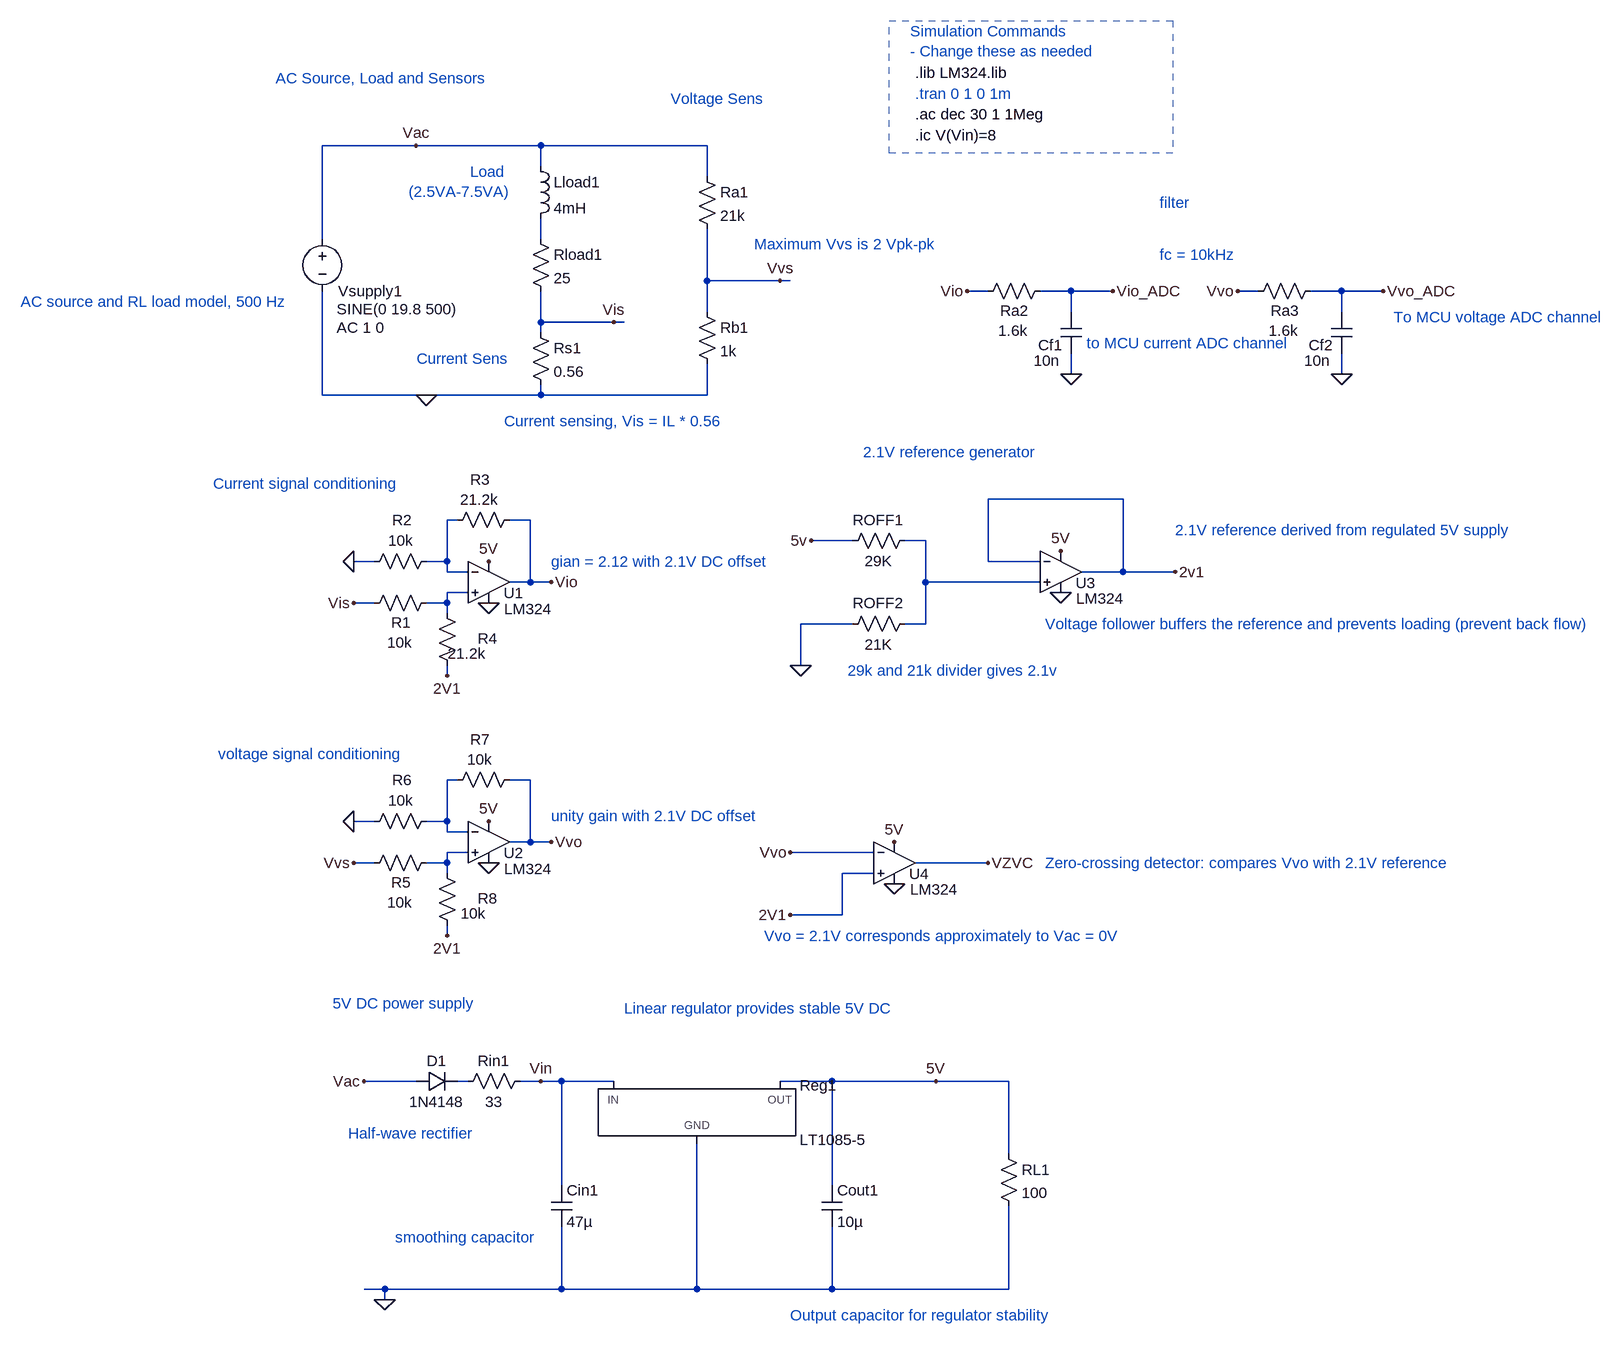
[diagram p0: schematic T28_Project1.asc]
T28_Project1.asc, the LTspice schematic file:
Version 4.1
SHEET 1 1580 1720
WIRE -320 -96 -464 -96
WIRE -128 -96 -320 -96
WIRE 128 -96 -128 -96
WIRE -128 -64 -128 -96
WIRE 128 -48 128 -96
WIRE -464 48 -464 -96
WIRE -128 48 -128 16
WIRE 128 112 128 32
WIRE 240 112 128 112
WIRE 256 112 240 112
WIRE 560 128 528 128
WIRE 688 128 640 128
WIRE 752 128 688 128
WIRE 976 128 944 128
WIRE 1104 128 1056 128
WIRE 1168 128 1104 128
WIRE 128 160 128 112
WIRE 688 160 688 128
WIRE 1104 160 1104 128
WIRE -128 176 -128 128
WIRE -16 176 -128 176
WIRE 0 176 -16 176
WIRE -128 192 -128 176
WIRE 688 256 688 224
WIRE 1104 256 1104 224
WIRE -464 288 -464 128
WIRE -304 288 -464 288
WIRE -128 288 -128 272
WIRE -128 288 -304 288
WIRE 128 288 128 240
WIRE 128 288 -128 288
WIRE 768 448 560 448
WIRE -256 480 -272 480
WIRE -144 480 -176 480
WIRE 352 512 288 512
WIRE 464 512 432 512
WIRE -384 544 -416 544
WIRE -272 544 -272 480
WIRE -272 544 -304 544
WIRE 560 544 560 448
WIRE 640 544 560 544
WIRE -272 560 -272 544
WIRE -240 560 -272 560
WIRE 768 560 768 448
WIRE 768 560 704 560
WIRE 848 560 768 560
WIRE -144 576 -144 480
WIRE -144 576 -176 576
WIRE -112 576 -144 576
WIRE 464 576 464 512
WIRE 640 576 464 576
WIRE -240 592 -272 592
WIRE -384 608 -416 608
WIRE -272 608 -272 592
WIRE -272 608 -304 608
WIRE -272 624 -272 608
WIRE 352 640 272 640
WIRE 464 640 464 576
WIRE 464 640 432 640
WIRE 272 704 272 640
WIRE -272 720 -272 704
WIRE -256 880 -272 880
WIRE -144 880 -176 880
WIRE -384 944 -416 944
WIRE -272 944 -272 880
WIRE -272 944 -304 944
WIRE -272 960 -272 944
WIRE -240 960 -272 960
WIRE -144 976 -144 880
WIRE -144 976 -176 976
WIRE -112 976 -144 976
WIRE -240 992 -272 992
WIRE 384 992 256 992
WIRE -384 1008 -416 1008
WIRE -272 1008 -272 992
WIRE -272 1008 -304 1008
WIRE 560 1008 448 1008
WIRE -272 1024 -272 1008
WIRE 384 1024 336 1024
WIRE 336 1088 336 1024
WIRE 336 1088 256 1088
WIRE -272 1120 -272 1104
WIRE -320 1344 -400 1344
WIRE -240 1344 -256 1344
WIRE -128 1344 -160 1344
WIRE -96 1344 -128 1344
WIRE -16 1344 -96 1344
WIRE 320 1344 240 1344
WIRE 480 1344 320 1344
WIRE 592 1344 480 1344
WIRE 592 1456 592 1344
WIRE -96 1504 -96 1344
WIRE 320 1504 320 1344
WIRE -368 1664 -400 1664
WIRE -96 1664 -96 1568
WIRE -96 1664 -368 1664
WIRE 112 1664 112 1440
WIRE 112 1664 -96 1664
WIRE 320 1664 320 1568
WIRE 320 1664 112 1664
WIRE 592 1664 592 1536
WIRE 592 1664 320 1664
WIRE -368 1680 -368 1664
FLAG -304 288 0
FLAG -320 -96 Vac
FLAG -16 176 Vis
FLAG 240 112 Vvs
FLAG -208 608 0
FLAG -208 544 5V
FLAG -416 608 Vis
FLAG -416 544 0
FLAG -112 576 Vio
FLAG -272 720 2V1
FLAG -208 1008 0
FLAG -208 944 5V
FLAG -416 1008 Vvs
FLAG -416 944 0
FLAG -112 976 Vvo
FLAG -272 1120 2V1
FLAG 288 512 5v
FLAG 272 704 0
FLAG 672 592 0
FLAG 672 528 5V
FLAG 848 560 2v1
FLAG 416 1040 0
FLAG 416 976 5V
FLAG 256 992 Vvo
FLAG 256 1088 2V1
FLAG 560 1008 VZVC
FLAG -368 1680 0
FLAG -400 1344 Vac
FLAG 480 1344 5V
FLAG -128 1344 Vin
FLAG 688 256 0
FLAG 528 128 Vio
FLAG 752 128 Vio_ADC
FLAG 1104 256 0
FLAG 944 128 Vvo
FLAG 1168 128 Vvo_ADC
SYMBOL voltage -464 32 R0
WINDOW 0 24 96 Left 2
WINDOW 3 22 124 Left 2
WINDOW 123 22 152 Left 2
WINDOW 39 0 0 Left 0
SYMATTR InstName Vsupply1
SYMATTR Value SINE(0 19.8 500)
SYMATTR Value2 AC 1 0
SYMBOL res -144 32 R0
SYMATTR InstName Rload1
SYMATTR Value 25
SYMBOL ind -144 -80 R0
SYMATTR InstName Lload1
SYMATTR Value 4mH
SYMBOL res -144 176 R0
SYMATTR InstName Rs1
SYMATTR Value 0.56
SYMBOL res 112 -64 R0
SYMATTR InstName Ra1
SYMATTR Value 21k
SYMBOL res 112 144 R0
SYMATTR InstName Rb1
SYMATTR Value 1k
SYMBOL Opamps/opamp2 -208 512 R0
WINDOW 0 23 81 Left 2
WINDOW 3 24 105 Left 2
SYMATTR InstName U1
SYMATTR Value LM324
SYMBOL res -288 592 R90
WINDOW 0 62 55 VBottom 2
WINDOW 3 61 57 VTop 2
SYMATTR InstName R1
SYMATTR Value 10k
SYMBOL res -288 528 R90
WINDOW 0 -32 53 VBottom 2
WINDOW 3 -32 55 VTop 2
SYMATTR InstName R2
SYMATTR Value 10k
SYMBOL res -160 464 R90
WINDOW 0 -30 61 VBottom 2
WINDOW 3 -31 62 VTop 2
SYMATTR InstName R3
SYMATTR Value 21.2k
SYMBOL res -256 720 R180
WINDOW 0 -62 57 Left 2
WINDOW 3 -44 34 Left 2
SYMATTR InstName R4
SYMATTR Value 21.2k
SYMBOL Opamps/opamp2 -208 912 R0
WINDOW 0 23 81 Left 2
WINDOW 3 24 105 Left 2
SYMATTR InstName U2
SYMATTR Value LM324
SYMBOL res -288 992 R90
WINDOW 0 62 55 VBottom 2
WINDOW 3 61 57 VTop 2
SYMATTR InstName R5
SYMATTR Value 10k
SYMBOL res -288 928 R90
WINDOW 0 -32 53 VBottom 2
WINDOW 3 -32 55 VTop 2
SYMATTR InstName R6
SYMATTR Value 10k
SYMBOL res -160 864 R90
WINDOW 0 -30 61 VBottom 2
WINDOW 3 -31 62 VTop 2
SYMATTR InstName R7
SYMATTR Value 10k
SYMBOL res -256 1120 R180
WINDOW 0 -62 57 Left 2
WINDOW 3 -44 34 Left 2
SYMATTR InstName R8
SYMATTR Value 10k
SYMBOL res 448 496 R90
WINDOW 0 0 56 VBottom 2
WINDOW 3 32 56 VTop 2
SYMATTR InstName ROFF1
SYMATTR Value 29K
SYMBOL res 448 624 R90
WINDOW 0 0 56 VBottom 2
WINDOW 3 32 56 VTop 2
SYMATTR InstName ROFF2
SYMATTR Value 21K
SYMBOL Opamps/opamp2 672 496 R0
WINDOW 0 23 81 Left 2
WINDOW 3 24 105 Left 2
SYMATTR InstName U3
SYMATTR Value LM324
SYMBOL Opamps/opamp2 416 944 R0
WINDOW 0 23 81 Left 2
WINDOW 3 24 105 Left 2
SYMATTR InstName U4
SYMATTR Value LM324
SYMBOL PowerProducts/LT1085-5 112 1344 R0
SYMATTR InstName Reg1
SYMBOL res 576 1440 R0
SYMATTR InstName RL1
SYMATTR Value 100
SYMBOL res -144 1328 R90
WINDOW 0 0 56 VBottom 2
WINDOW 3 32 56 VTop 2
SYMATTR InstName Rin1
SYMATTR Value 33
SYMBOL diode -320 1360 R270
WINDOW 0 32 32 VTop 2
WINDOW 3 0 32 VBottom 2
SYMATTR InstName D1
SYMATTR Value 1N4148
SYMBOL cap -112 1504 R0
SYMATTR InstName Cin1
SYMATTR Value 47µ
SYMATTR SpiceLine Rser=0.001
SYMBOL cap 304 1504 R0
SYMATTR InstName Cout1
SYMATTR Value 10µ
SYMATTR SpiceLine Rser=0.001
SYMBOL res 656 112 R90
WINDOW 0 62 55 VBottom 2
WINDOW 3 61 57 VTop 2
SYMATTR InstName Ra2
SYMATTR Value 1.6k
SYMBOL cap 704 224 R180
WINDOW 0 29 13 Left 2
WINDOW 3 33 -11 Left 2
SYMATTR InstName Cf1
SYMATTR Value 10n
SYMBOL res 1072 112 R90
WINDOW 0 62 55 VBottom 2
WINDOW 3 61 57 VTop 2
SYMATTR InstName Ra3
SYMATTR Value 1.6k
SYMBOL cap 1120 224 R180
WINDOW 0 29 13 Left 2
WINDOW 3 33 -11 Left 2
SYMATTR InstName Cf2
SYMATTR Value 10n
TEXT -536 -200 Left 2 ;AC Source, Load and Sensors
TEXT -176 -56 Right 2 ;Load \n(2.5VA-7.5VA)
TEXT -176 232 Right 2 ;Current Sens
TEXT 72 -168 Left 2 ;Voltage Sens
TEXT 448 -144 Left 2 !.ac dec 30 1 1Meg
TEXT 448 -208 Left 2 !.lib LM324.lib
TEXT 440 -272 Left 2 ;Simulation Commands\n- Change these as needed
TEXT 448 -176 Left 2 ;.tran 0 1 0 1m
TEXT 448 -112 Left 2 !.ic V(Vin)=8
TEXT -448 1224 Left 2 ;5V DC power supply
TEXT -928 144 Left 2 ;AC source and RL load model, 500 Hz
TEXT -184 328 Left 2 ;Current sensing, Vis = IL * 0.56
TEXT 200 56 Left 2 ;Maximum Vvs is 2 Vpk-pk
TEXT -112 544 Left 2 ;gian = 2.12 with 2.1V DC offset
TEXT -112 936 Left 2 ;unity gain with 2.1V DC offset
TEXT 824 72 Left 2 ;fc = 10kHz
TEXT 848 496 Left 2 ;2.1V reference derived from regulated 5V supply
TEXT 344 712 Left 2 ;29k and 21k divider gives 2.1v
TEXT 648 640 Left 2 ;Voltage follower buffers the reference and prevents loading (prevent back flow)
TEXT 648 1008 Left 2 ;Zero-crossing detector: compares Vvo with 2.1V reference
TEXT 216 1120 Left 2 ;Vvo = 2.1V corresponds approximately to Vac = 0V
TEXT -424 1424 Left 2 ;Half-wave rectifier
TEXT -352 1584 Left 2 ;smoothing capacitor
TEXT 0 1232 Left 2 ;Linear regulator provides stable 5V DC
TEXT 256 1704 Left 2 ;Output capacitor for regulator stability
TEXT 712 208 Left 2 ;to MCU current ADC channel
TEXT 1184 168 Left 2 ;To MCU voltage ADC channel
TEXT -632 424 Left 2 ;Current signal conditioning
TEXT -624 840 Left 2 ;voltage signal conditioning
TEXT 824 -8 Left 2 ;filter
TEXT 368 376 Left 2 ;2.1V reference generator
RECTANGLE Normal 408 -288 844 -84 2

The netlist it stands for:
* T28_Project1.asc
Vsupply1 Vac 0 SINE(0 19.8 500) AC 1 0
Rload1 N001 Vis 25
Lload1 Vac N001 4mH
Rs1 Vis 0 0.56
Ra1 Vac Vvs 21k
Rb1 Vvs 0 1k
X§U1 N004 N002 5V 0 Vio LM324  ; pins In+ In- V+ V- OUT
R1 N004 Vis 10k
R2 N002 0 10k
R3 Vio N002 21.2k
R4 2V1 N004 21.2k
X§U2 N006 N005 5V 0 Vvo LM324  ; pins In+ In- V+ V- OUT
R5 N006 Vvs 10k
R6 N005 0 10k
R7 Vvo N005 10k
R8 2V1 N006 10k
ROFF1 N003 5V 29K
ROFF2 N003 0 21K
X§U3 N003 2V1 5V 0 2V1 LM324  ; pins In+ In- V+ V- OUT
X§U4 2V1 Vvo 5V 0 VZVC LM324  ; pins In+ In- V+ V- OUT
X§Reg1 0 5V Vin LT1085-5  ; pins GND OUT IN
RL1 5V 0 100
Rin1 Vin N007 33
D1 Vac N007 1N4148
Cin1 Vin 0 47µ Rser=0.001
Cout1 5V 0 10µ Rser=0.001
Ra2 Vio_ADC Vio 1.6k
Cf1 0 Vio_ADC 10n
Ra3 Vvo_ADC Vvo 1.6k
Cf2 0 Vvo_ADC 10n
.model D D
.lib standard.dio
* AC Source, Load and Sensors
* Load
* (2.5VA-7.5VA)
* Current Sens
* Voltage Sens
.ac dec 30 1 1Meg
.lib LM324.lib
* Simulation Commands
* - Change these as needed
* .tran 0 1 0 1m
.ic V(Vin)=8
* 5V DC power supply
* AC source and RL load model, 500 Hz
* Current sensing, Vis = IL * 0.56
* Maximum Vvs is 2 Vpk-pk
* gian = 2.12 with 2.1V DC offset
* unity gain with 2.1V DC offset
* fc = 10kHz
* 2.1V reference derived from regulated 5V supply
* 29k and 21k divider gives 2.1v
* Voltage follower buffers the reference and prevents loading (prevent back flow)
* Zero-crossing detector: compares Vvo with 2.1V reference
* Vvo = 2.1V corresponds approximately to Vac = 0V
* Half-wave rectifier
* smoothing capacitor
* Linear regulator provides stable 5V DC
* Output capacitor for regulator stability
* to MCU current ADC channel
* To MCU voltage ADC channel
* Current signal conditioning
* voltage signal conditioning
* filter
* 2.1V reference generator
.backanno
.end